# EAGLE design heartbeat (EAGLE 6.3)
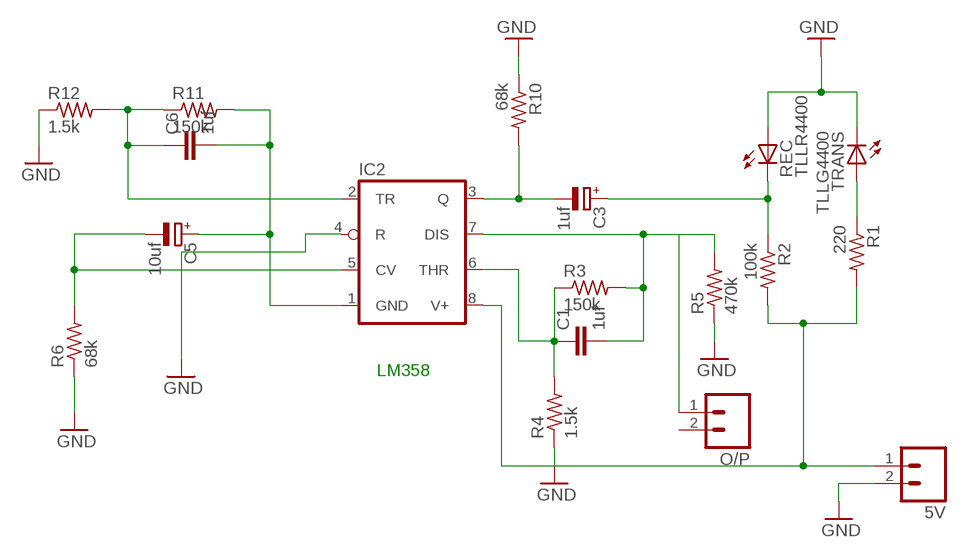
[diagram p0: schematic, sheet 1]

## Parts
5V  M02  [02P]
C1  1uf  C-EU025-030X050  [C025-030X050]
C3  1uf  CPOL-EUTT2D4  [TT2D4]
C5  10uf  CPOL-EUTT2D4  [TT2D4]
C6  1uf  C-EU025-030X050  [C025-030X050]
IC2  LM555N  [DIL08-ROUND]
O/P  M02  [02P]
R1  220  R-US_0207/10  [0207/10]
R2  100k  R-US_0207/10  [0207/10]
R3  150k  R-US_0207/10  [0207/10]
R4  1.5k  R-US_0207/10  [0207/10]
R5  470k  R-US_0207/10  [0207/10]
R6  68k  R-US_0207/10  [0207/10]
R10  68k  R-US_0207/10  [0207/10]
R11  150k  R-US_0207/10  [0207/10]
R12  1.5k  R-US_0207/10  [0207/10]
REC  TLLR4400  [LED3MM]
TRANS  TLLG4400  [LED3MM]

## Nets
GND: 5V.2 IC2.4(R) R4.1 R5.1 R6.1 R10.1 R12.1 REC.A TRANS.K(C)
N$1: R1.1 TRANS.A
N$2: C3.+ R2.1 REC.K(C)
N$3: C1.1 IC2.6(THR) R3.1 R4.2
N$4: 5V.1 IC2.8(V+) R1.2 R2.2
N$5: C3.- IC2.3(Q) R10.2
N$6: C1.2 IC2.7(DIS) O/P.1 R3.2 R5.2
N$9: C5.- IC2.5(CV) R6.2
N$12: C6.1 IC2.2(TR) R11.1 R12.2
N$13: C5.+ C6.2 IC2.1(GND) R11.2
Unconnected: O/P.2

## Notes on the sheet
- LM358

## Library data of the parts
5V O/P = con-amp-quick:M02: AMP QUICK CONNECTOR; OC_FARNELL: unknown; OC_NEWARK: unknown
C1 C6 = resistor:C-EU: CAPACITOR, European symbol
C3 C5 = resistor:CPOL-EU: POLARIZED CAPACITOR, European symbol
IC2 = adafruit:*555: TIMER Changed DIP package to have round (not oval) pin pads http://www.ladyada.net/library/pcb/eaglelibrary.html
R1-R6 R10-R12 = resistor:R-US_: RESISTOR, American symbol
REC = led:TLLR4400: Low Current (2mA) LED 3 mm Tinted Diffused Package color RED Source: Data sheet <http://www.farnell.com/datasheets/391100.pdf>; MF: VISHAY SEMICONDUCTOR; OC_FARNELL: 1612437
TRANS = led:TLLG4400: Low Current (2mA) LED 3 mm Tinted Diffused Package color GREEN Source: Data sheet <http://www.farnell.com/datasheets/391098.pdf>; MF: VISHAY SEMICONDUCTOR; OC_FARNELL: 1612435

## Net classes
0 default: width 0.305 mm, drill 0.508 mm, clearance 0.254 mm

## Board
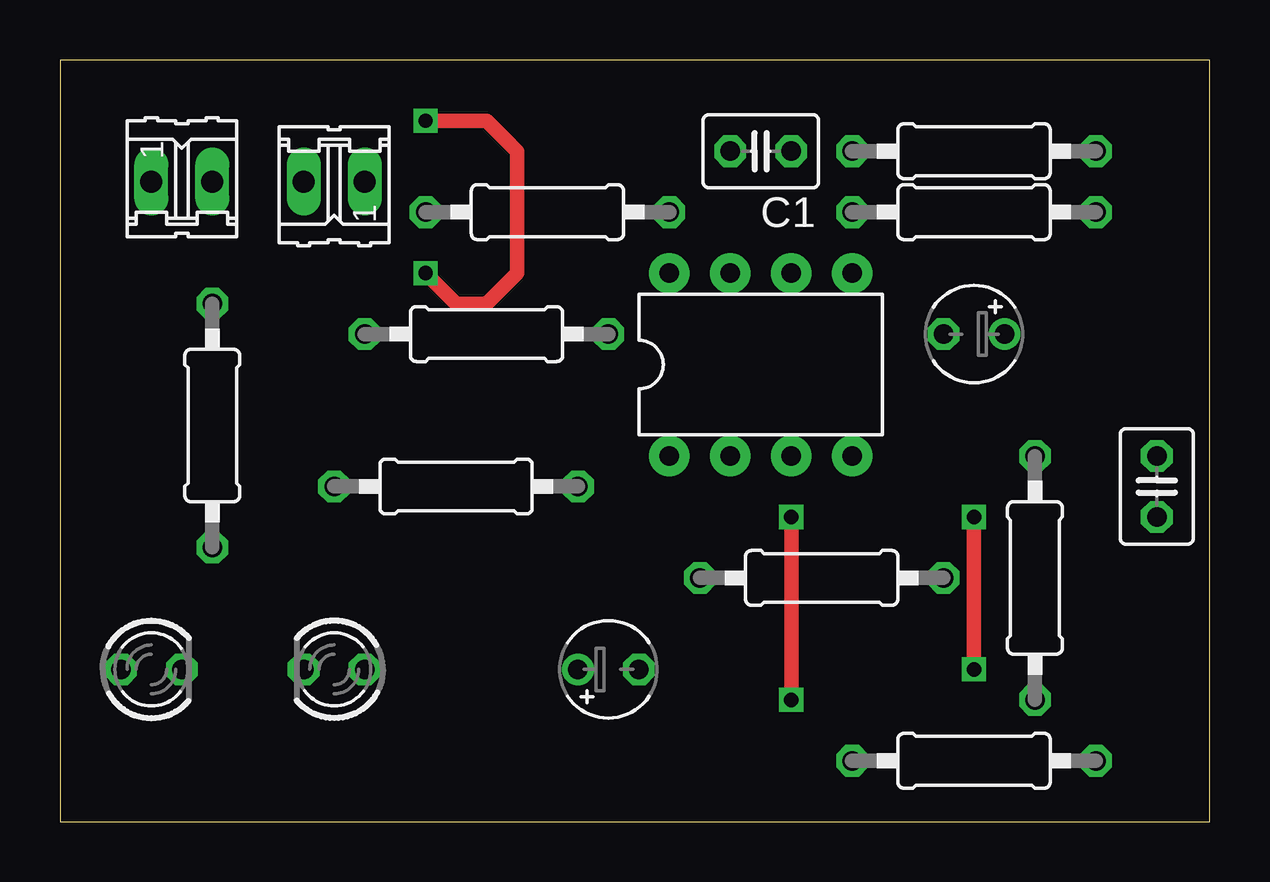
[diagram p1: board, top side]
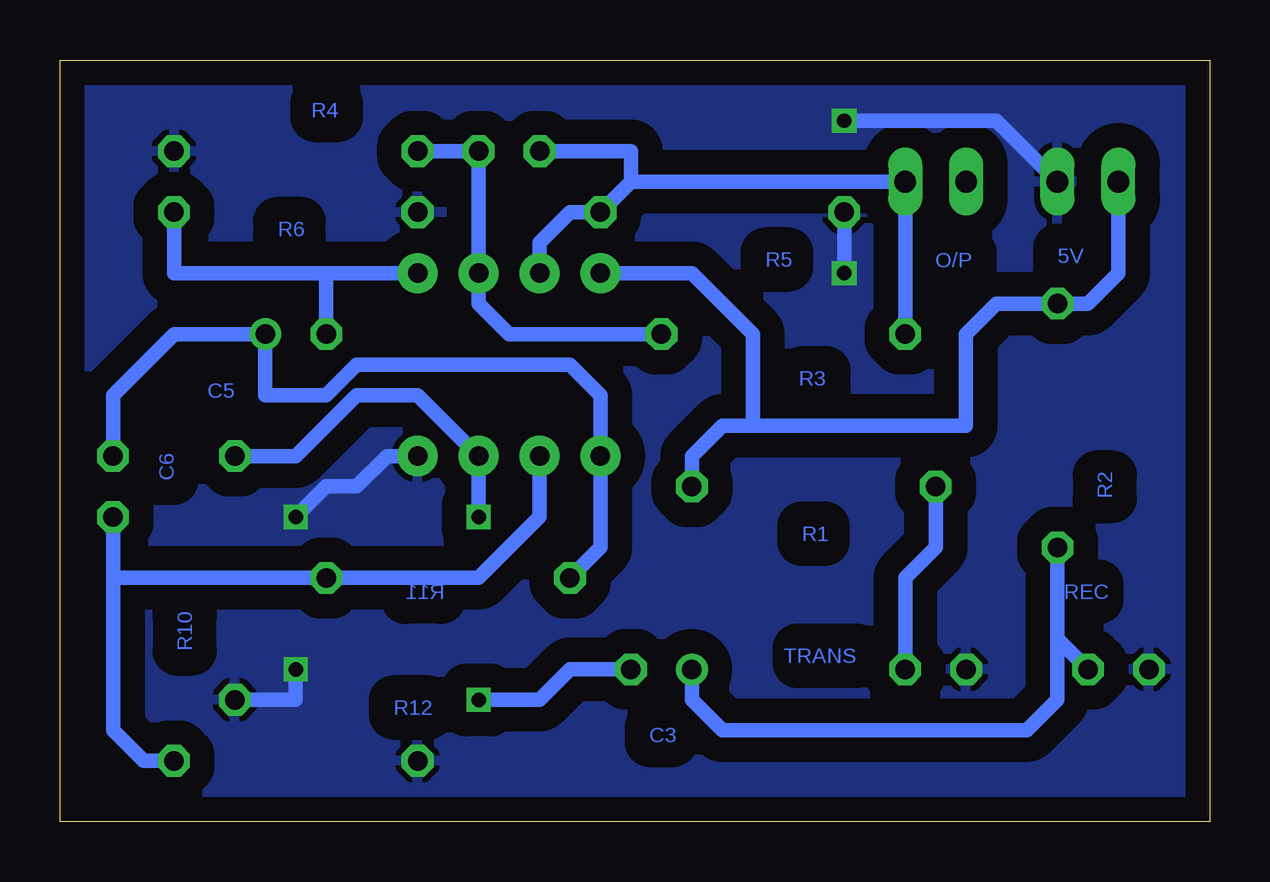
[diagram p2: board, bottom side, seen from below]

Size 47.93 x 31.74 mm. Coordinates in mm from the lower left corner, seen from the top.
Outline: 0,0 47.93,0 47.93,31.74 0,31.74 0,0
Copper layers (1*16): Top 0.035mm / dielectric 1.5mm / Bottom 0.035mm
Design rules "default": minimum track width 10mil, minimum drill 24mil, track to track 8mil, track to pad 8mil, pad to pad 8mil, via to via 8mil, smd to smd 8mil, copper to edge 40mil, drill to drill 8mil, minimum pad ring 10mil, minimum via ring 8mil, stop-mask expansion 4mil, vias tented up to drill 0mil, thermal gap 10mil

### Footprints (pad centres in the part's own frame; a part is rotated, then mirrored left to right if it is on the bottom)
02P = drill 0.914 long: 1 -1.27,0; 2 1.27,0
C025-030X050 = drill 0.813 octagon: 1 -1.27,0; 2 1.27,0
TT2D4 = drill 0.813: + -1.27,0 | drill 0.813 octagon: - 1.27,0
DIL08-ROUND = drill 0.813 pad 1.676: 1 -3.81,-3.81; 2 -1.27,-3.81; 3 1.27,-3.81; 4 3.81,-3.81; 5 3.81,3.81; 6 1.27,3.81; 7 -1.27,3.81; 8 -3.81,3.81
0207/10 = drill 0.813 octagon: 1 -5.08,0; 2 5.08,0
LED3MM = drill 0.813 octagon: A -1.27,0; K 1.27,0

### Placement (x,y rotation side)
5V  5.08,26.67 0 top
C1  29.21,27.94 180 top
C3  22.86,6.35 0 top
C5  38.1,20.32 180 top
C6  45.72,13.97 90 top
IC2  29.21,19.05 0 top
O/P  11.43,26.67 180 top
R1  16.51,13.97 0 top
R2  6.35,16.51 90 top
R3  17.78,20.32 180 top
R4  38.1,27.94 180 top
R5  20.32,25.4 0 top
R6  38.1,25.4 0 top
R10  40.64,10.16 90 top
R11  31.75,10.16 180 top
R12  38.1,2.54 0 top
REC  3.81,6.35 0 top
TRANS  11.43,6.35 180 top

### Tracks (layer width: path | path; a pad name or v marks a point on that pad's centre or on a via)
GND  (via drill 0.6)
  Top 0.61: v15.24,29.21 17.78,29.21 19.05,27.94 19.05,22.86 17.78,21.59 16.51,21.59 v15.24,22.86 | v38.1,12.7 v38.1,6.35
  Bottom 0.61: 5V.2 8.89,29.21 v15.24,29.21 | v15.24,22.86 R5.1 | IC2.4 34.29,15.24 35.56,13.97 36.83,13.97 v38.1,12.7 | v38.1,6.35 38.1,5.08 R10.1
  pour Bottom (isolate 1.016): 0,38.1 54.61,38.1 54.61,-5.08 -1.27,-5.08 -2.54,38.1
N$1
  Bottom 0.61: R1.1 11.43,11.43 12.7,10.16 TRANS.A
N$2
  Bottom 0.61: R2.1 6.35,7.62 | 6.35,7.62 REC.K | 6.35,7.62 6.35,5.08 7.62,3.81 20.32,3.81 21.59,5.08 C3.+
N$3
  Bottom 0.61: R4.2 C1.1 IC2.6 30.48,21.59 29.21,20.32 R3.1
N$4
  Bottom 0.61: 5V.1 3.81,22.86 5.08,21.59 R2.2 8.89,21.59 10.16,20.32 10.16,16.51 19.05,16.51 | 19.05,16.51 20.32,16.51 21.59,15.24 R1.2 | IC2.8 21.59,22.86 19.05,20.32 19.05,16.51
N$5  (via drill 0.6)
  Top 0.61: v30.48,5.08 v30.48,12.7
  Bottom 0.61: C3.- 26.67,6.35 27.94,5.08 v30.48,5.08 | v30.48,12.7 IC2.3 33.02,17.78 35.56,17.78 38.1,15.24 R10.2
N$6
  Bottom 0.61: R3.2 O/P.1 24.13,26.67 | 24.13,26.67 R5.2 26.67,25.4 27.94,24.13 IC2.7 | C1.2 24.13,27.94 24.13,26.67
N$9
  Bottom 0.61: R6.2 43.18,22.86 36.83,22.86 | 36.83,22.86 IC2.5 | C5.- 36.83,22.86
N$12
  Bottom 0.61: 45.72,10.16 45.72,3.81 44.45,2.54 R12.2 | C6.1 45.72,10.16 | 45.72,10.16 R11.1 30.48,10.16 27.94,12.7 IC2.2
N$13
  Bottom 0.61: R11.2 25.4,11.43 IC2.1 25.4,17.78 26.67,19.05 35.56,19.05 36.83,17.78 39.37,17.78 C5.+ 43.18,20.32 45.72,17.78 C6.2